# Altium schematic sheet Signal.SchDoc
size A4; SheetNumber: 2; SheetTotal: 3
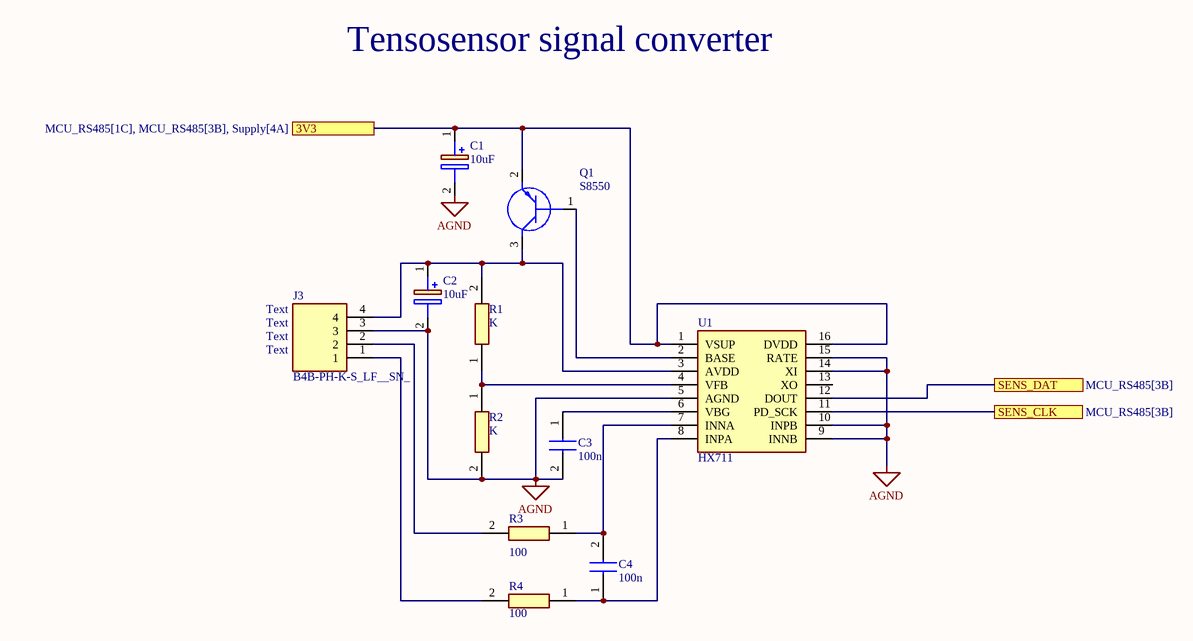
[diagram p0: Signal.SchDoc]

## Parts
C1  10uF  [CAPPM3216X180N]
C2  10uF  [CAPPM3216X180N]
C3  100n  [CAPC2012X94N]
C4  100n  [CAPC2012X94N]
J3  B4B-PH-K-S_LF__SN_  [SHDR4W50P0X200_1X4_990X450X600P]
Q1  S8550  [SOT95P240X110-3N]
R1  K  [RESC2012X65N]
R2  K  [RESC2012X65N]
R3  100  [RESC2012X65N]
R4  100  [RESC2012X65N]
U1  HX711  [SOIC127P600X160-16N]

## Ports
3V3 (see MCU_RS485[1C], MCU_RS485[3B], Supply[4A]), SENS_CLK (see MCU_RS485[3B]), SENS_DAT (see MCU_RS485[3B])

## Nets
AGND: C1.2(-) C2.2(-) C3.2 J3.3 R2.2 U1.5(AGND) U1.9(INNB) U1.10(INPB) U1.14(XI) U1.15(RATE)
3V3: C1.1(+) Q1.2(E) U1.1(VSUP) U1.16(DVDD) ; port 3V3
SENS_CLK: U1.11(PD_SCK) ; port SENS_CLK
SENS_DAT: U1.12(DOUT) ; port SENS_DAT
NetC2_1: C2.1(+) J3.4 Q1.3(C) R1.2 U1.3(AVDD)
NetC3_1: C3.1 U1.6(VBG)
NetC4_1: C4.1 R4.1 U1.8(INPA)
NetC4_2: C4.2 R3.1 U1.7(INNA)
NetJ3_1: J3.1 R4.2
NetJ3_2: J3.2 R3.2
NetQ1_1: Q1.1(B) U1.2(BASE)
NetR1_1: R1.1 R2.1 U1.4(VFB)

Not connected (* = marked no-connect by the designer): U1 13(XO)

## Notes on the sheet
- Tensosensor signal converter
- Text

## Library data of the parts
C1 C2 = 293D105X9016AW2E3: Capacitor Polarised; Manufacturer_Name: Vishay; Datasheet Link: http://www.vishay.com/docs/40002/293d.pdf; Height: 1.8mm; Manufacturer_Part_Number: 293D105X9016AW2E3
C3 C4 = 08055A471FAT4A: Capacitor; Manufacturer_Name: AVX; Datasheet Link: https://componentsearchengine.com/Datasheets/1/06031A100FAT2A.pdf; Height: 0.94mm; Manufacturer_Part_Number: 08055A471FAT4A; Mouser Part Number: 581-08055A471FAT4A; Mouser Price/Stock: https://www.mouser.com/Search/Refine.aspx?Keyword=581-08055A471FAT4A; Arrow Part Number: 08055A471FAT4A; Arrow Price/Stock: https://www.arrow.com/en/products/08055a471fat4a/avx
J3 = B4B-PH-K-S_LF__SN_: Connector; Manufacturer_Name: JST (JAPAN SOLDERLESS TERMINALS); Manufacturer_Part_Number: B4B-PH-K-S(LF)(SN); Datasheet Link: https://datasheet.lcsc.com/szlcsc/JST-Sales-America-B4B-PH-K-S-LF-SN_C131334.pdf; Height: 6mm; Arrow Part Number: B4B-PH-K-S(LF)(SN); Arrow Price/Stock: https://www.arrow.com/en/products/b4b-ph-k-s-lf-sn/jst-manufacturing?region=europe
Q1 = S8550: Transistor BJT PNP; Manufacturer_Name: Galaxy; Datasheet Link: https://datasheet.datasheetarchive.com/originals/distributors/Datasheets-3/DSA-49109.pdf; Height: 1.1mm; Manufacturer_Part_Number: S8550
R1-R4 = CPF0805B102KE1: Resistor; Manufacturer_Name: TE Connectivity; Datasheet Link: http://docs-europe.electrocomponents.com/webdocs/13d1/0900766b813d116f.pdf; Height: 0.65mm; Manufacturer_Part_Number: CPF0805B102KE1; Mouser Part Number: 279-CPF0805B102KE1; Mouser Price/Stock: https://www.mouser.com/Search/Refine.aspx?Keyword=279-CPF0805B102KE1
U1 = HX711: Integrated Circuit; Manufacturer_Name: AVIA; Datasheet Link: https://cdn.sparkfun.com/datasheets/Sensors/ForceFlex/hx711_english.pdf; Height: 1.6mm; Manufacturer_Part_Number: HX711